# Altium project MB1165.PrjPCB (part 4 of 4)
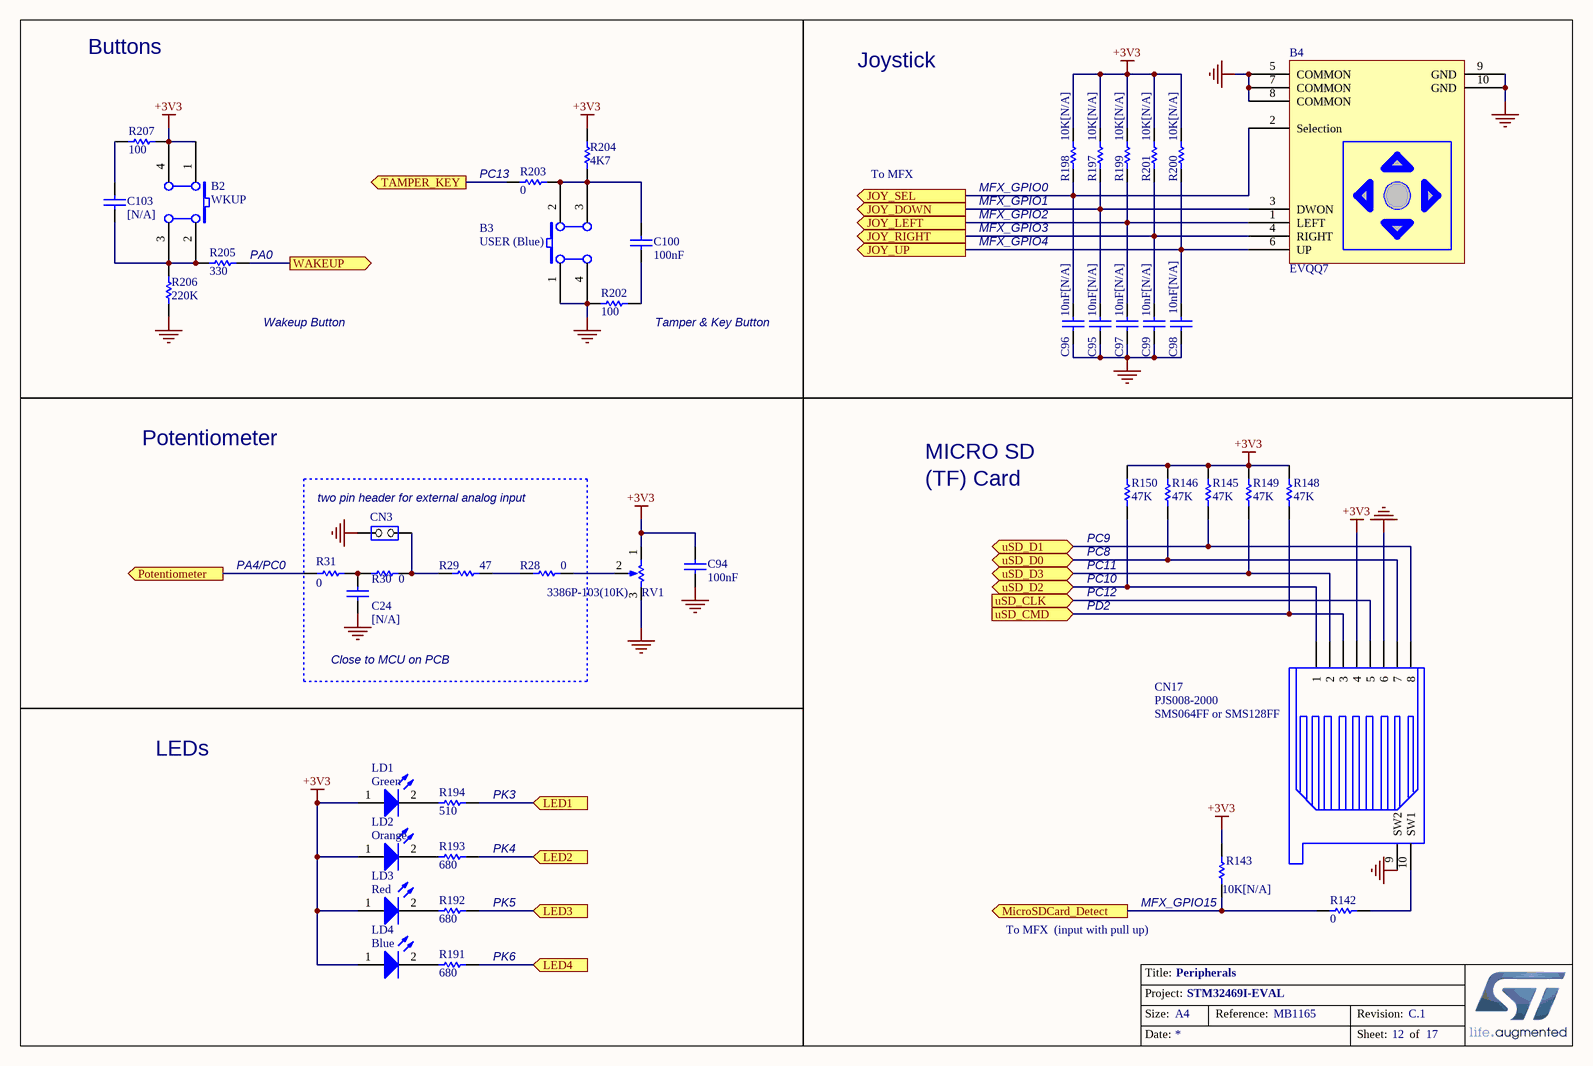
[diagram p17: Peripherals.SchDoc]

## Nets that join several sheets
+1V8: Audio (6 pins), Power (C67.1 TP1.1 U20.2 U20.4), LCD&Camera&Connectors (8 pins)
+2V8: Power (5 pins), LCD&Camera&Connectors (8 pins)
+3V3: MB1165 (R151.1 R152.1), Audio (11 pins), CAN&QSPI (7 pins), Ethernet (23 pins), ExtensionConnector (CN5.48 CN6.48 CN11.40), JTAG&Trace (8 pins), Memory (45 pins), MotorControl (CN1.28 R14.2), Power (11 pins), RS232&IrDA (8 pins), ST_LINK_V2-1 (R169.1), USB_OTG (15 pins), USB_OTG_FS (R108.2 R120.2 R121.1), MFX (13 pins), MCU (JP10.1 R21.2 SW1.1 SW2.1), LCD&Camera&Connectors (6 pins), Peripherals (22 pins)
+5V: ExtensionConnector (CN5.60 CN6.60), MotorControl (CN1.25), Power (11 pins), ST_LINK_V2-1 (D15.1), USB_OTG (U7.5), USB_OTG_FS (U11.5), LCD&Camera&Connectors (L4.1 L8.1)
D5V: ExtensionConnector (CN5.49 CN6.49), Power (JP14.7), ST_LINK_V2-1 (D7.1)
E5V: Power (C60.1 JP14.9 L5.3), ST_LINK_V2-1 (D12.1)
GND: Audio (43 pins), CAN&QSPI (12 pins), Ethernet (20 pins), ExtensionConnector (22 pins), JTAG&Trace (24 pins), Memory (40 pins), MotorControl (27 pins), Power (18 pins), RS232&IrDA (14 pins), ST_LINK_V2-1 (35 pins), USB_OTG (38 pins), USB_OTG_FS (12 pins), MFX (16 pins), MCU (68 pins), LCD&Camera&Connectors (41 pins), Peripherals (20 pins)
U5V_ST_LINK: Power (JP14.11), ST_LINK_V2-1 (C59.2 SB24.2 U18.6 U18.7)
VBUS_FS1: ExtensionConnector (CN6.54), Power (JP14.3), ST_LINK_V2-1 (D9.1), USB_OTG_FS (5 pins), MCU (R253.2)
VBUS_FS2: Power (JP14.5), ST_LINK_V2-1 (D10.1), USB_OTG (CN14.1 D6.B3 R126.1 SB14.1), MCU (R255.1)
VBUS_HS: Power (JP14.1), ST_LINK_V2-1 (D8.1), USB_OTG (CN8.1 D3.A1 L2.2)
VDD_MCU: Power (5 pins), MCU (41 pins)
A0: ExtensionConnector (CN11.14), Memory (U9.E2 U15.G8 U16.A3), MCU (R236.2)
A1: ExtensionConnector (CN11.12), Memory (U9.D2 U15.G9 U16.A4), MCU (R232.2)
A2: ExtensionConnector (CN11.8), Memory (U9.C2 U15.F7 U16.A5), MCU (R230.2)
A3: ExtensionConnector (CN11.5), Memory (U9.A2 U15.F3 U16.B3), MCU (R226.2)
A4: ExtensionConnector (CN11.3), Memory (U9.B2 U15.G1 U16.B4), MCU (R223.2)
A5: ExtensionConnector (CN11.1), Memory (U9.D3 U15.G2 U16.C3), MCU (R221.2)
A6: ExtensionConnector (CN10.5), Memory (U9.C3 U15.G3 U16.C4), MCU (R248.2)
A7: ExtensionConnector (CN10.3), Memory (U9.A3 U15.H1 U16.D4), MCU (R245.2)
A8: ExtensionConnector (CN10.4), Memory (U9.B6 U15.H2 U16.H2), MCU (R249.2)
A9: ExtensionConnector (CN10.18), Memory (U9.A6 U15.J3 U16.H3), MCU (R261.2)
A10: ExtensionConnector (CN10.6), Memory (U9.C6 U15.G7 U16.H4), MCU (R251.2)
A11: ExtensionConnector (CN10.7), Memory (U9.D6 U15.H9 U16.H5), MCU (R250.2)
A12: ExtensionConnector (CN10.33), Memory (U9.B7 U16.G3), MCU (R269.2)
A13: ExtensionConnector (CN10.34), Memory (U9.A7 U16.G4), MCU (R257.2)
A14: ExtensionConnector (CN10.28), Memory (U9.C7 U15.J7 U16.F3), MCU (R270.2)
A15: ExtensionConnector (CN10.25), Memory (U9.D7 U15.H8 U16.F4), MCU (R259.2)
A16: ExtensionConnector (CN10.21), Memory (U9.E7 U16.E4), MCU (R260.1)
A17: ExtensionConnector (CN10.23), Memory (U9.B3 U16.D3), MCU (R271.2)
A18: ExtensionConnector (CN10.31), Memory (U9.C4 U16.H1), MCU (R258.2)
A19: ExtensionConnector (CN11.13), Memory (U9.D5 U16.G2), MCU (R37.2 R234.2)
A20: ExtensionConnector (CN11.11), Memory (U9.D4 U16.H6), MCU (R35.2 R231.2)
A21: ExtensionConnector (CN11.4), Memory (U9.C5), MCU (R24.2 R32.2)
A22: ExtensionConnector (CN11.7), Memory (U9.B8), MCU (R34.2 R229.2)
A23: ExtensionConnector (CN11.16), Memory (U9.C8), MCU (R38.2 R39.2)
D0: ExtensionConnector (CN10.39), Memory (U9.E3 U15.R8 U16.B6), MCU (R268.2)
D1: ExtensionConnector (CN10.38), Memory (U9.H3 U15.N7 U16.C5), MCU (R256.2)
D2: ExtensionConnector (CN11.31), Memory (U9.E4 U15.R9 U16.C6), MCU (R262.2)
D3: ExtensionConnector (CN11.32), Memory (U9.H4 U15.N8 U16.D5), MCU (R273.2)
D4: ExtensionConnector (CN10.11), Memory (U9.H5 U15.P9 U16.E5), MCU (R58.2)
D5: ExtensionConnector (CN10.14), Memory (U9.E5 U15.M8 U16.F5), MCU (R50.2)
D6: ExtensionConnector (CN10.12), Memory (U9.H6 U15.M7 U16.F6), MCU (R49.2)
D7: ExtensionConnector (CN10.13), Memory (U9.E6 U15.L8 U16.G6), MCU (R59.2)
D8: ExtensionConnector (CN10.16), Memory (U9.F3 U15.L2 U16.B1), MCU (R51.2)
D9: ExtensionConnector (CN10.15), Memory (U9.G3 U15.M3 U16.C1), MCU (R60.2)
D10: ExtensionConnector (CN10.19), Memory (U9.F4 U15.M2 U16.C2), MCU (R62.2)
D11: ExtensionConnector (CN10.20), Memory (U9.G4 U15.P1 U16.D2), MCU (R52.2)
D12: ExtensionConnector (CN10.17), Memory (U9.F5 U15.N2 U16.E2), MCU (R61.2)
D13: ExtensionConnector (CN10.35), Memory (U9.G6 U15.R1 U16.F2), MCU (R56.2)
D14: ExtensionConnector (CN10.37), Memory (U9.F6 U15.N3 U16.F1), MCU (R65.2)
D15: ExtensionConnector (CN10.36), Memory (U9.G7 U15.R2 U16.G1), MCU (R66.2)
D16: ExtensionConnector (CN10.22), Memory (U15.E8), MCU (R53.1)
D17: ExtensionConnector (CN10.26), Memory (U15.D7), MCU (R54.1)
D18: ExtensionConnector (CN10.24), Memory (U15.D8), MCU (R63.1)
D19: ExtensionConnector (CN10.27), Memory (U15.B9), MCU (R64.1)
D20: ExtensionConnector (CN10.32), Memory (U15.C8), MCU (R55.1)
D21: ExtensionConnector (CN11.39), Memory (U15.A9), MCU (R266.1)
D22: ExtensionConnector (CN11.38), Memory (U15.C7), MCU (R276.1)
D23: ExtensionConnector (CN11.36), Memory (U15.A8), MCU (R275.1)
D24: ExtensionConnector (CN11.37), Memory (U15.A2), MCU (R265.1)
D25: ExtensionConnector (CN11.35), Memory (U15.C3), MCU (R264.1)
D26: ExtensionConnector (CN11.33), Memory (U15.A1), MCU (R263.1)
D27: ExtensionConnector (CN11.34), Memory (U15.C2), MCU (R274.1)
D28: ExtensionConnector (CN11.22), Memory (U15.B1), MCU (R247.1)
D29: ExtensionConnector (CN11.18), Memory (U15.D2), MCU (R240.1)
D30: ExtensionConnector (CN11.20), Memory (U15.D3), MCU (R241.1)
D31: ExtensionConnector (CN11.21), Memory (U15.E2), MCU (R244.1)
I2C1_SCL: MB1165 (R151.2), Audio (R179.1), ExtensionConnector (CN6.31), MFX (R287.1), MCU (U4.A7), LCD&Camera&Connectors (5 pins)
I2C1_SDA: MB1165 (R152.2), Audio (R172.1), ExtensionConnector (CN6.14), MFX (R288.1), MCU (U4.B4), LCD&Camera&Connectors (5 pins)
I2S3_CK: ExtensionConnector (CN6.58), MCU (JP5.3 SB82.1 U4.H15), LCD&Camera&Connectors (CN4.23)
LCD_B0: ExtensionConnector (CN6.27), MCU (U4.B10), LCD&Camera&Connectors (CN18.21)
LCD_B1: ExtensionConnector (CN6.15), MCU (U4.C7), LCD&Camera&Connectors (CN18.23)
LCD_B2: ExtensionConnector (CN6.20), MCU (U4.C9), LCD&Camera&Connectors (CN18.25)
LCD_B3: ExtensionConnector (CN6.22), MCU (U4.D10), LCD&Camera&Connectors (CN18.27)
LCD_B4: ExtensionConnector (CN6.16), MCU (U4.D8), LCD&Camera&Connectors (CN18.29), Peripherals (R194.1)
LCD_B5: ExtensionConnector (CN6.13), MCU (U4.D7), LCD&Camera&Connectors (CN18.31), Peripherals (R193.1)
LCD_B6: ExtensionConnector (CN6.12), MCU (U4.C6), LCD&Camera&Connectors (CN18.33), Peripherals (R192.1)
LCD_B7: ExtensionConnector (CN6.11), MCU (U4.C5), LCD&Camera&Connectors (CN18.35), Peripherals (R191.1)
LCD_BL_CTRL: MCU (SB80.1), LCD&Camera&Connectors (CN15.53 CN18.43)
LCD_G0: MCU (SB51.1), LCD&Camera&Connectors (CN18.4)
LCD_G1: MCU (SB76.1), LCD&Camera&Connectors (CN18.6)
LCD_G2: ExtensionConnector (CN6.5), MCU (U4.G4), LCD&Camera&Connectors (CN18.8)
LCD_G3: ExtensionConnector (CN6.17), MCU (U4.C8), LCD&Camera&Connectors (CN18.10)
LCD_G4: ExtensionConnector (CN6.26), MCU (U4.B9), LCD&Camera&Connectors (CN18.12)
LCD_G5: MCU (SB57.2), LCD&Camera&Connectors (CN18.14)
LCD_G6: MCU (SB30.2), LCD&Camera&Connectors (CN18.16)
LCD_G7: MCU (SB28.1), LCD&Camera&Connectors (CN18.18)
LCD_R0: MCU (SB8.2), LCD&Camera&Connectors (CN18.3)
LCD_R1: ExtensionConnector (CN5.54), MCU (U4.R6), LCD&Camera&Connectors (CN18.5)
LCD_R2: ExtensionConnector (CN5.58), MCU (U4.R7), LCD&Camera&Connectors (CN18.7)
LCD_R3: ExtensionConnector (CN5.56), MCU (U4.P7), LCD&Camera&Connectors (CN15.49 CN18.9)
LCD_R4: ExtensionConnector (CN5.31), MCU (U4.N8), LCD&Camera&Connectors (CN18.11)
LCD_R5: ExtensionConnector (CN5.34), MCU (U4.M9), LCD&Camera&Connectors (CN18.13)
LCD_R6: ExtensionConnector (CN5.42), MCU (U4.M14), LCD&Camera&Connectors (CN18.15)
LCD_R7: ExtensionConnector (CN5.51), MCU (U4.J15), LCD&Camera&Connectors (CN18.17)
MII_TXD0: Ethernet (U6.3), MCU (R36.2 SB27.1)
NetB4_1: MFX (U22.20), Peripherals (B4.1 C97.2 R199.2)
NetB4_2: MFX (U22.18), Peripherals (B4.2 C96.2 R198.2)
NetB4_3: MFX (U22.19), Peripherals (B4.3 C95.2 R197.2)
NetB4_4: MFX (U22.39), Peripherals (B4.4 C99.2 R201.2)
NetB4_6: MFX (U22.40), Peripherals (B4.6 C98.2 R200.2)
NetC6_2: MotorControl (C6.2 CN1.31 SB2.2), MCU (SB46.1)
NetC7_2: MotorControl (C7.2 CN1.27 SB1.2), MCU (SB66.1)
NetC8_2: MotorControl (C8.2 CN1.33), MCU (SB33.1)
NetC9_2: MotorControl (C9.2 CN1.34), MCU (SB42.1)
NetC10_2: MotorControl (C10.2 CN1.29), MCU (SB68.1)
NetC11_1: MotorControl (C11.1 R8.2), MCU (SB69.2)
NetC12_2: MotorControl (C12.2 R9.1), MCU (SB59.2)
NetC13_2: MotorControl (C13.2 R10.1), MCU (SB49.2)
NetC14_2: MotorControl (C14.2 R11.1), MCU (SB41.2)
NetC15_1: MotorControl (C15.1 R12.2 R13.1), MCU (SB52.2)
NetC18_2: MotorControl (C18.2 SB1.1), MCU (SB75.1)
NetCN1_3: MotorControl (CN1.3), MCU (SB82.2)
NetCN1_5: MotorControl (CN1.5), MCU (SB43.1)
NetCN1_9: MotorControl (CN1.9), MCU (SB64.1)
NetCN1_11: MotorControl (CN1.11), MCU (SB78.2)
NetCN1_13: MotorControl (CN1.13), MCU (SB61.1)
NetCN1_21: MotorControl (CN1.21), MCU (SB60.2)
NetCN1_23: MotorControl (CN1.23), MCU (SB58.2)
NetCN4_15: MFX (U22.33), LCD&Camera&Connectors (CN4.15 R218.2)
NetCN4_17: MFX (U22.32), LCD&Camera&Connectors (CN4.17 R220.1)
NetCN4_19: MFX (U22.31), LCD&Camera&Connectors (CN4.19 R225.1)
NetCN4_31: MCU (SB47.1), LCD&Camera&Connectors (CN4.31)
NetCN11_6: ExtensionConnector (CN11.6), Memory (R86.1 U9.A4), MCU (JP6.1)
NetCN12_12: JTAG&Trace (CN12.12 U13.1), MCU (SB11.1)
NetCN12_14: JTAG&Trace (CN12.14 R102.1 U10.5), MCU (SB10.1)
NetCN12_16: JTAG&Trace (CN12.16 R104.1 U10.4), MCU (SB6.1)
NetCN12_18: JTAG&Trace (CN12.18 U10.3), MCU (SB3.1)
NetCN12_20: JTAG&Trace (CN12.20 U10.1), MCU (SB18.1)
NetCN14_4: USB_OTG (CN14.4 D6.A3), MCU (SB70.1)
NetCN15_3: MCU (U4.H12), LCD&Camera&Connectors (CN15.3)
NetCN15_5: MCU (U4.H13), LCD&Camera&Connectors (CN15.5)
NetCN15_9: MCU (U4.J12), LCD&Camera&Connectors (CN15.9)
NetCN15_11: MCU (U4.J13), LCD&Camera&Connectors (CN15.11)
NetCN15_15: MCU (U4.F12), LCD&Camera&Connectors (CN15.15)
NetCN15_17: MCU (U4.F13), LCD&Camera&Connectors (CN15.17)
NetCN17_1: MCU (R278.1), Peripherals (CN17.1 R150.2)
NetCN17_2: MCU (R272.1), Peripherals (CN17.2 R149.2)
NetCN17_3: MCU (SB83.1), Peripherals (CN17.3 R148.2)
NetCN17_7: MCU (SB81.2), Peripherals (CN17.7 R146.2)
NetCN17_8: MCU (R252.1), Peripherals (CN17.8 R145.2)
NetD1_1: RS232&IrDA (U5.20), MCU (D1.1)
NetD5_C3: USB_OTG_FS (D5.C3 R280.2), MCU (SB71.1)
NetD6_C3: USB_OTG (D6.C3 R283.2), MCU (SB62.1)
NetD6_D3: USB_OTG (D6.D3 R284.2), MCU (SB65.1)
NetJP3_2: MB1165 (JP3.2), Peripherals (R31.2)
NetJP4_2: RS232&IrDA (U5.16), MCU (JP4.2)
NetJP6_3: Audio (JP17.3), MCU (JP6.3)
NetJP7_3: Ethernet (JP7.3), MCU (SB77.1)
NetJP8_2: MB1165 (JP15.1), RS232&IrDA (JP8.2)
NetJP9_2: CAN&QSPI (U24.4), MCU (JP9.2)
NetJP18_3: Audio (JP18.3), MCU (R277.2)
NetJP19_1: MB1165 (JP19.1), RS232&IrDA (U1.3 U5.13)
NetJP19_2: MB1165 (JP19.2), MCU (SB72.1)
NetR43_2: Ethernet (R43.2), MCU (SB55.2)
NetR44_2: Ethernet (R44.2), MCU (SB73.2)
NetR45_2: Ethernet (R45.2), MCU (SB53.2)
NetR46_2: Ethernet (R46.2), MCU (SB45.1)
NetR47_2: Ethernet (R47.2), MCU (SB39.1)
NetR57_2: Ethernet (R57.2), MCU (SB54.2)
NetR68_2: Ethernet (R68.2 U6.7), MFX (U22.26)
NetR69_1: Ethernet (R69.1 U6.30), MCU (SB40.1)
NetR111_1: USB_OTG (R111.1), MFX (U22.29)
NetR117_2: USB_OTG_FS (R117.2), MFX (U22.17)
NetR119_1: USB_OTG_FS (R119.1), MFX (U22.16)
NetR142_1: MFX (U22.28), Peripherals (R142.1 R143.1)
NetR163_2: MFX (R163.2), MCU (SB44.1), Peripherals (R205.2)
NetR233_2: Ethernet (U6.5), MCU (R233.2)
NetR235_2: Ethernet (U6.4), MCU (R235.2)
NetR238_1: Ethernet (U6.6), MCU (R238.1)
NetR242_2: Ethernet (U6.2), MCU (R242.2)
NetSB5_1: Audio (U23.G1), MCU (SB5.1)
NetSB7_1: Audio (U23.E3), MCU (SB7.1)
NetSB9_1: Audio (U23.F2), MCU (SB9.1)
NetSB12_2: Ethernet (U6.41), MCU (SB12.2)
NetSB15_1: USB_OTG (SB15.1), MFX (U22.30)
NetSB19_1: Audio (U23.E4), MCU (SB19.1)
NetSB31_2: Ethernet (U6.31), MCU (SB31.2)
NetSB32_2: USB_OTG (U8.12), MCU (SB32.2)
NetSB34_2: USB_OTG (U8.13), MCU (SB34.2)
NetSB48_1: Ethernet (U6.40), MCU (SB48.1)
NetSB56_2: USB_OTG (U8.11), MCU (SB56.2)
NetSB63_2: Ethernet (U6.42), MCU (SB63.2)
NetSB67_1: CAN&QSPI (U24.1), MCU (SB67.1)
NetU22_15: Audio (U23.G3), MFX (U22.15)
PA0: ExtensionConnector (CN5.15), MCU (SB44.2 SB46.2 SB48.2 U4.N3)
PA1: ExtensionConnector (CN5.14), MCU (SB33.2 SB39.2 U4.N2)
PA2: ExtensionConnector (CN5.13), MCU (SB40.2 SB42.2 U4.P2)
PA3: ExtensionConnector (CN5.18), USB_OTG (R82.2), MCU (U4.R2)
PA4: MB1165 (JP3.1), ExtensionConnector (CN5.21), MCU (SB47.2 U4.N4)
PA5: ExtensionConnector (CN5.24), USB_OTG (R113.2), MCU (U4.P4)
PA6: ExtensionConnector (CN5.20), MotorControl (R15.2), MCU (U4.P3), LCD&Camera&Connectors (CN4.33)
PA7: ExtensionConnector (CN5.22), MCU (SB43.2 SB45.2 U4.R3)
PA8: ExtensionConnector (CN6.52), MCU (SB75.2 SB77.2 SB80.2 U4.F15)
PA9: ExtensionConnector (CN6.43), MCU (R253.1 SB72.2 U4.E15)
PA10: MB1165 (JP15.2), ExtensionConnector (CN6.44), USB_OTG_FS (R107.2), MCU (U4.D15)
PA11: ExtensionConnector (CN6.41), USB_OTG_FS (D5.D3 R281.2), MCU (JP9.1 SB68.2 U4.C15)
PA12: ExtensionConnector (CN6.42), MCU (SB66.2 SB67.2 SB71.2 U4.B15)
PA13: ExtensionConnector (CN6.40), JTAG&Trace (R80.2), ST_LINK_V2-1 (U21.25 U21.27), MCU (U4.A15)
PA14: ExtensionConnector (CN6.36), JTAG&Trace (R87.2), ST_LINK_V2-1 (U21.15 U21.26), MCU (U4.A14)
PA15: ExtensionConnector (CN6.32), JTAG&Trace (R93.2), ST_LINK_V2-1 (U21.17), MCU (U4.A13)
PAR_D1: ExtensionConnector (CN6.56), MotorControl (CN1.7), MCU (R277.1 U4.G15), LCD&Camera&Connectors (CN4.24)
PAR_D2: ExtensionConnector (CN6.51), MCU (SB78.1 SB81.1 U4.G14), LCD&Camera&Connectors (CN4.25)
PAR_D3: ExtensionConnector (CN6.46), MCU (R252.2 U4.F14), LCD&Camera&Connectors (CN4.26)
PAR_D4: ExtensionConnector (CN6.53), MCU (R272.2 U4.B13), LCD&Camera&Connectors (CN4.27)
PAR_D5: ExtensionConnector (CN6.23), MCU (U4.C11), LCD&Camera&Connectors (CN4.28)
PAR_D6: MCU (SB4.1), LCD&Camera&Connectors (CN4.29)
PAR_D7: MCU (SB17.1), LCD&Camera&Connectors (CN4.30)
PAR_D8: ExtensionConnector (CN6.55), MCU (R278.2 U4.B14), LCD&Camera&Connectors (CN4.9 R17.2)
PAR_D9: ExtensionConnector (CN6.28), MCU (U4.A12), LCD&Camera&Connectors (CN4.10), Peripherals (CN17.5)
PAR_D10: ExtensionConnector (CN6.47), MCU (JP6.2 U4.B11), LCD&Camera&Connectors (CN4.5)
PAR_D11: ExtensionConnector (CN6.57), MCU (SB83.2 U4.D12), LCD&Camera&Connectors (CN4.6)
PB0: ExtensionConnector (CN5.52), MCU (SB76.2 SB79.2 U4.R5)
PB1: ExtensionConnector (CN5.26), MCU (SB50.2 SB51.2 U4.R4)
PB2: ExtensionConnector (CN5.29), MCU (R6.2 U4.M5)
PB3: ExtensionConnector (CN6.45), MCU (JP5.2 U4.A10)
PB4: ExtensionConnector (CN6.24), JTAG&Trace (R103.2), ST_LINK_V2-1 (U21.19), MCU (U4.A9)
PB5: ExtensionConnector (CN5.4), MCU (SB28.2 SB29.2 U4.A8)
PB6: CAN&QSPI (R215.2 U3.7), ExtensionConnector (CN6.18), MCU (R40.2)
PB7: ExtensionConnector (CN6.21), MCU (U4.B5), LCD&Camera&Connectors (CN4.32)
PB10: ExtensionConnector (CN5.33), USB_OTG (R94.2), MCU (U4.P12)
PB11: ExtensionConnector (CN5.36), USB_OTG (R98.2), MCU (U4.R13)
PB12: ExtensionConnector (CN5.41), MCU (R254.2 SB70.2 SB74.2 U4.L13)
PB13: ExtensionConnector (CN5.43), USB_OTG (R109.2), MCU (R255.2 U4.K14)
PB14: ExtensionConnector (CN5.35), MCU (SB64.2 SB65.2 U4.R14)
PB15: ExtensionConnector (CN5.38), MCU (SB61.2 SB62.2 U4.R15)
PC0: MB1165 (JP3.3), ExtensionConnector (CN5.11), MCU (SB34.1 U4.M2)
PC1: ExtensionConnector (CN5.16), MCU (SB31.1 SB41.1 U4.M3)
PC2: ExtensionConnector (CN5.23), MCU (R233.1 SB49.1 U4.M4)
PC3: ExtensionConnector (CN5.27), MCU (SB54.1 SB59.1 U4.L4)
PC4: ExtensionConnector (CN5.25), MCU (SB52.1 SB53.1 U4.N5)
PC5: ExtensionConnector (CN5.46), MCU (SB69.1 SB73.1 U4.P5)
PC13: ExtensionConnector (CN6.6), MCU (U4.D1), Peripherals (R203.2)
PC14: ExtensionConnector (SB35.1), MCU (R19.2 U4.E1)
PC15: ExtensionConnector (SB36.1), MCU (R18.2 U4.F1)
PD4: ExtensionConnector (CN11.28), Memory (U9.G2 U16.A2), MCU (U4.D11)
PD5: ExtensionConnector (CN11.26), Memory (R99.2), MCU (U4.C10)
PD7: ExtensionConnector (CN11.24), Memory (R85.2), MCU (U4.A11)
PE0: ExtensionConnector (CN11.25), Memory (U15.K9 U16.A1), MCU (U4.A6)
PE1: ExtensionConnector (CN11.23), Memory (U15.K1 U16.B2), MCU (U4.A5)
PF6: CAN&QSPI (R227.2), ExtensionConnector (CN5.7), MCU (R25.2)
PF7: CAN&QSPI (R217.1), ExtensionConnector (CN5.8), MCU (R23.2)
PF8: CAN&QSPI (R228.1), ExtensionConnector (CN5.17), MCU (R237.2)
PF9: CAN&QSPI (R216.2), ExtensionConnector (CN5.12), MCU (R27.2)
PF10: CAN&QSPI (U3.16), ExtensionConnector (CN5.9), MCU (R222.2)
PF11: ExtensionConnector (CN10.8), Memory (U15.J9), MCU (R48.2)
PG7: Audio (U23.D3), ExtensionConnector (CN5.47), MCU (U4.J14)
PG8: ExtensionConnector (CN10.40), Memory (U15.J1), MCU (R267.2)
PG9: ExtensionConnector (CN11.27), Memory (R135.2), MCU (U4.D9)
PG11: ExtensionConnector (CN6.33), MCU (R242.1 SB60.1 U4.B8)
PG13: ExtensionConnector (CN6.25), MCU (R36.1 SB8.1 U4.B3)
PG14: ExtensionConnector (CN6.29), MCU (R235.1 U4.A4)
PG15: ExtensionConnector (CN11.19), Memory (U15.K7), MCU (R41.2)
PH0: ExtensionConnector (SB37.1), MCU (R20.1 U4.G1)
PH1: ExtensionConnector (SB38.1), MCU (C23.1 U4.H1 X1.1)
PH2: ExtensionConnector (CN11.2), Memory (R285.2), MCU (U4.K4)
PH3: ExtensionConnector (CN10.1), Memory (U15.J8), MCU (R243.1)
PH4: ExtensionConnector (CN5.28), MCU (SB56.1 SB57.1 U4.H4)
PH5: ExtensionConnector (CN10.2), Memory (U15.K8), MCU (R246.1)
PH6: ExtensionConnector (CN5.37), MCU (SB55.1 SB58.1 U4.P13)
PH7: Ethernet (R42.2), ExtensionConnector (CN5.40), MCU (U4.N13)
PI4: ExtensionConnector (CN11.17), Memory (U15.F8), MCU (U4.C3)
PI5: ExtensionConnector (CN11.15), Memory (U15.F2), MCU (U4.D3)
PI8: ExtensionConnector (CN6.9), MFX (R290.1), MCU (U4.C2)
PI11: ExtensionConnector (CN5.2), MCU (SB30.1 SB32.1 U4.F3)
PI12: ExtensionConnector (CN6.7), MCU (U4.E3), LCD&Camera&Connectors (CN18.26)
PI13: ExtensionConnector (CN6.2), MCU (U4.G3), LCD&Camera&Connectors (CN18.28)
PI14: ExtensionConnector (CN5.32), MCU (R214.1), LCD&Camera&Connectors (CN18.32)
PK7: ExtensionConnector (CN6.8), MCU (U4.C4), LCD&Camera&Connectors (CN15.57 R125.1 R153.2)
RESET#: Ethernet (U6.29), ExtensionConnector (R213.1), JTAG&Trace (R96.2), ST_LINK_V2-1 (U21.18), USB_OTG (R114.2), MFX (D16.2), MCU (5 pins)
STLINK_RX: MB1165 (JP19.3), ST_LINK_V2-1 (CN24.1 U21.13)
STLINK_TX: MB1165 (JP15.3), ST_LINK_V2-1 (CN24.2 U21.12)
T_JTDO: JTAG&Trace (R92.2), ST_LINK_V2-1 (U21.16 U21.31), MCU (JP5.1)
TOUCH_INT: MFX (U22.27), LCD&Camera&Connectors (CN15.4 CN18.39)
ULPI_D1: USB_OTG (U8.23), MCU (SB79.1)
ULPI_D2: USB_OTG (U8.22), MCU (SB50.1)
ULPI_D5: USB_OTG (U8.19), MCU (SB74.1)
ULPI_D7: USB_OTG (U8.17), MCU (SB29.1)